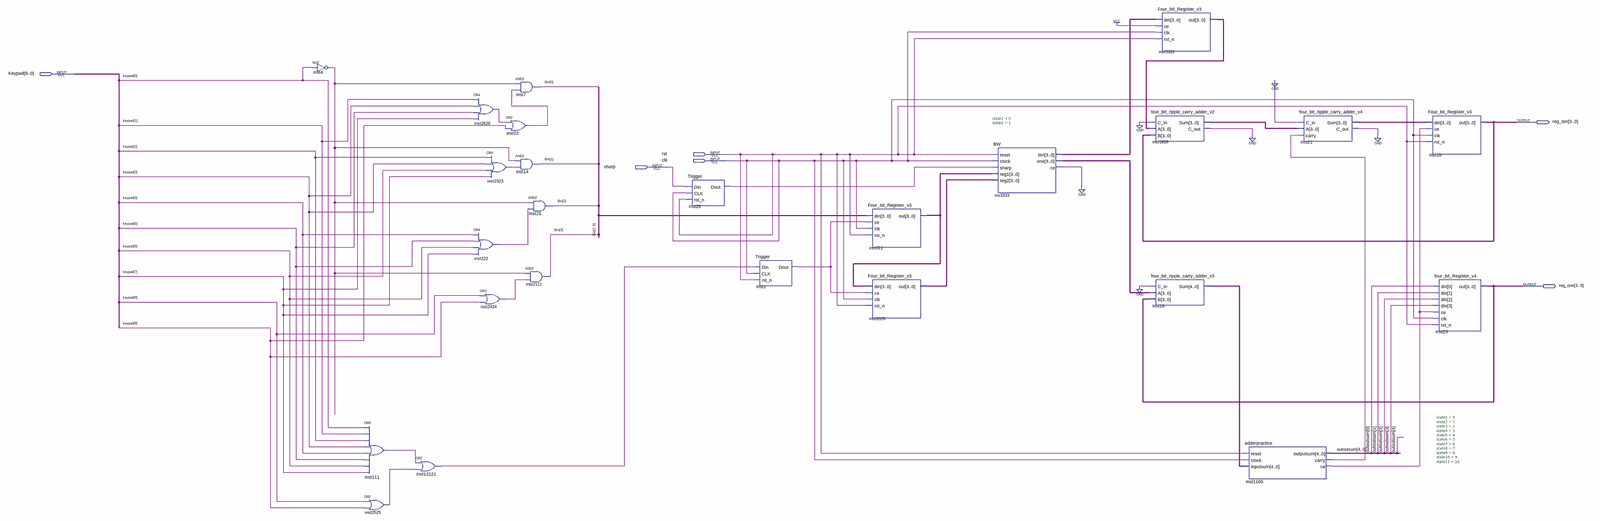
[diagram p0: schematic sheet, whole]
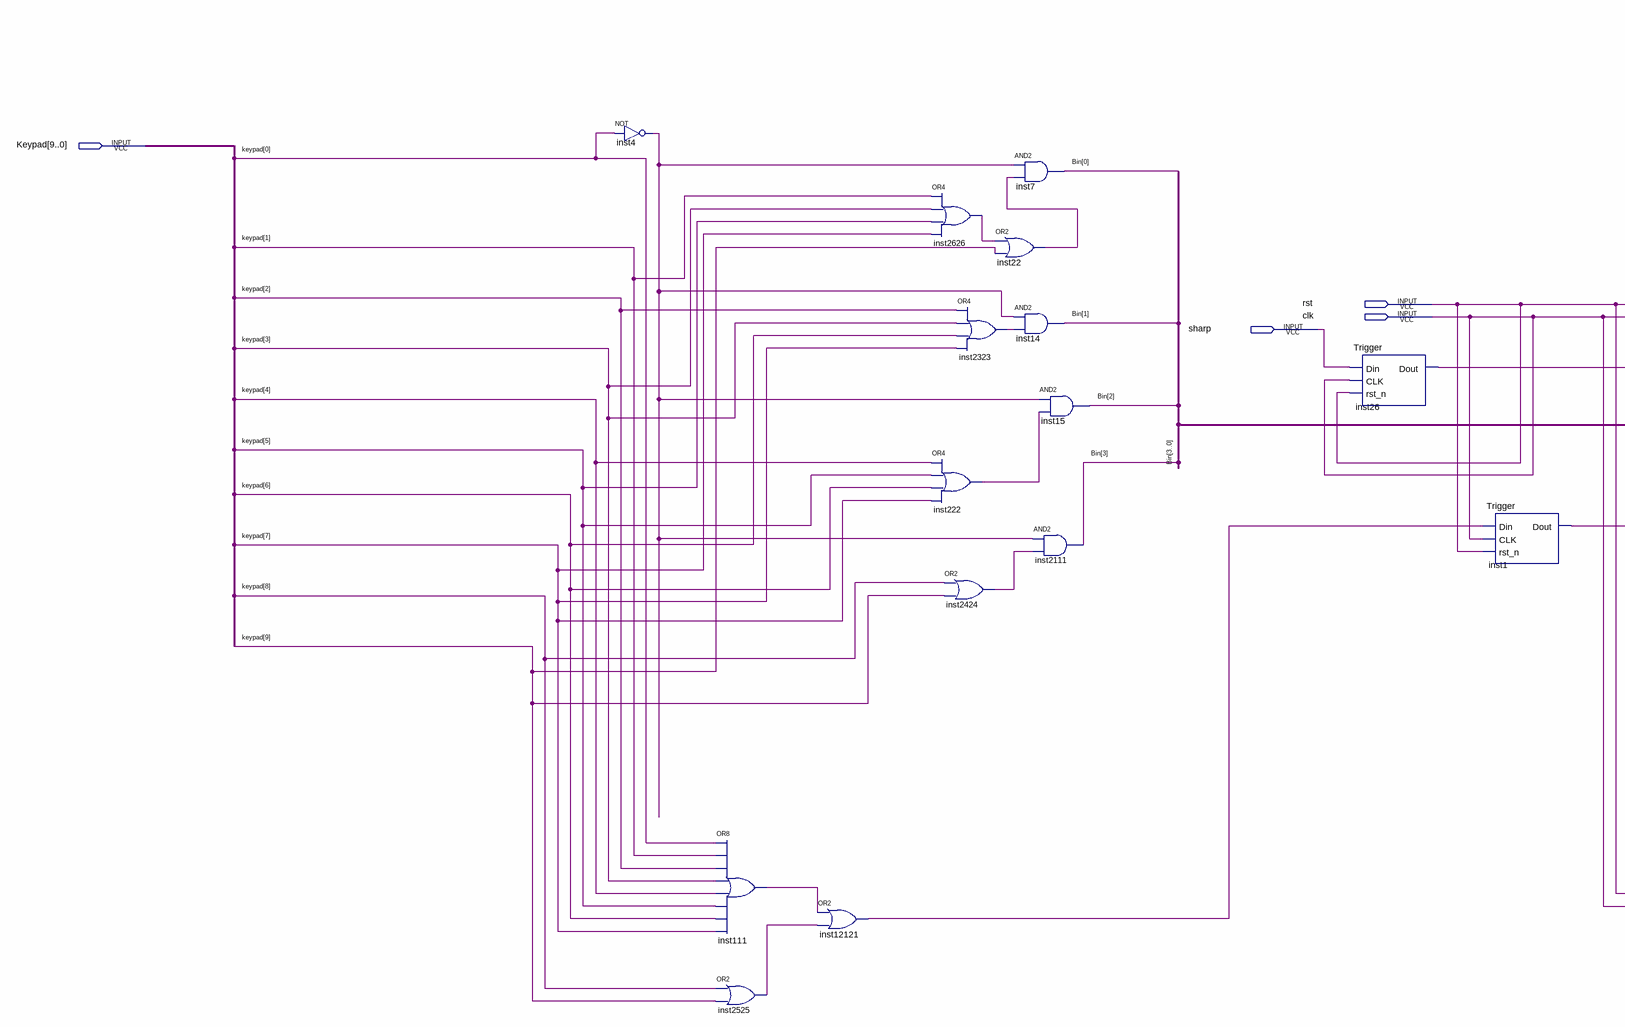
[diagram p1: schematic sheet, left part]
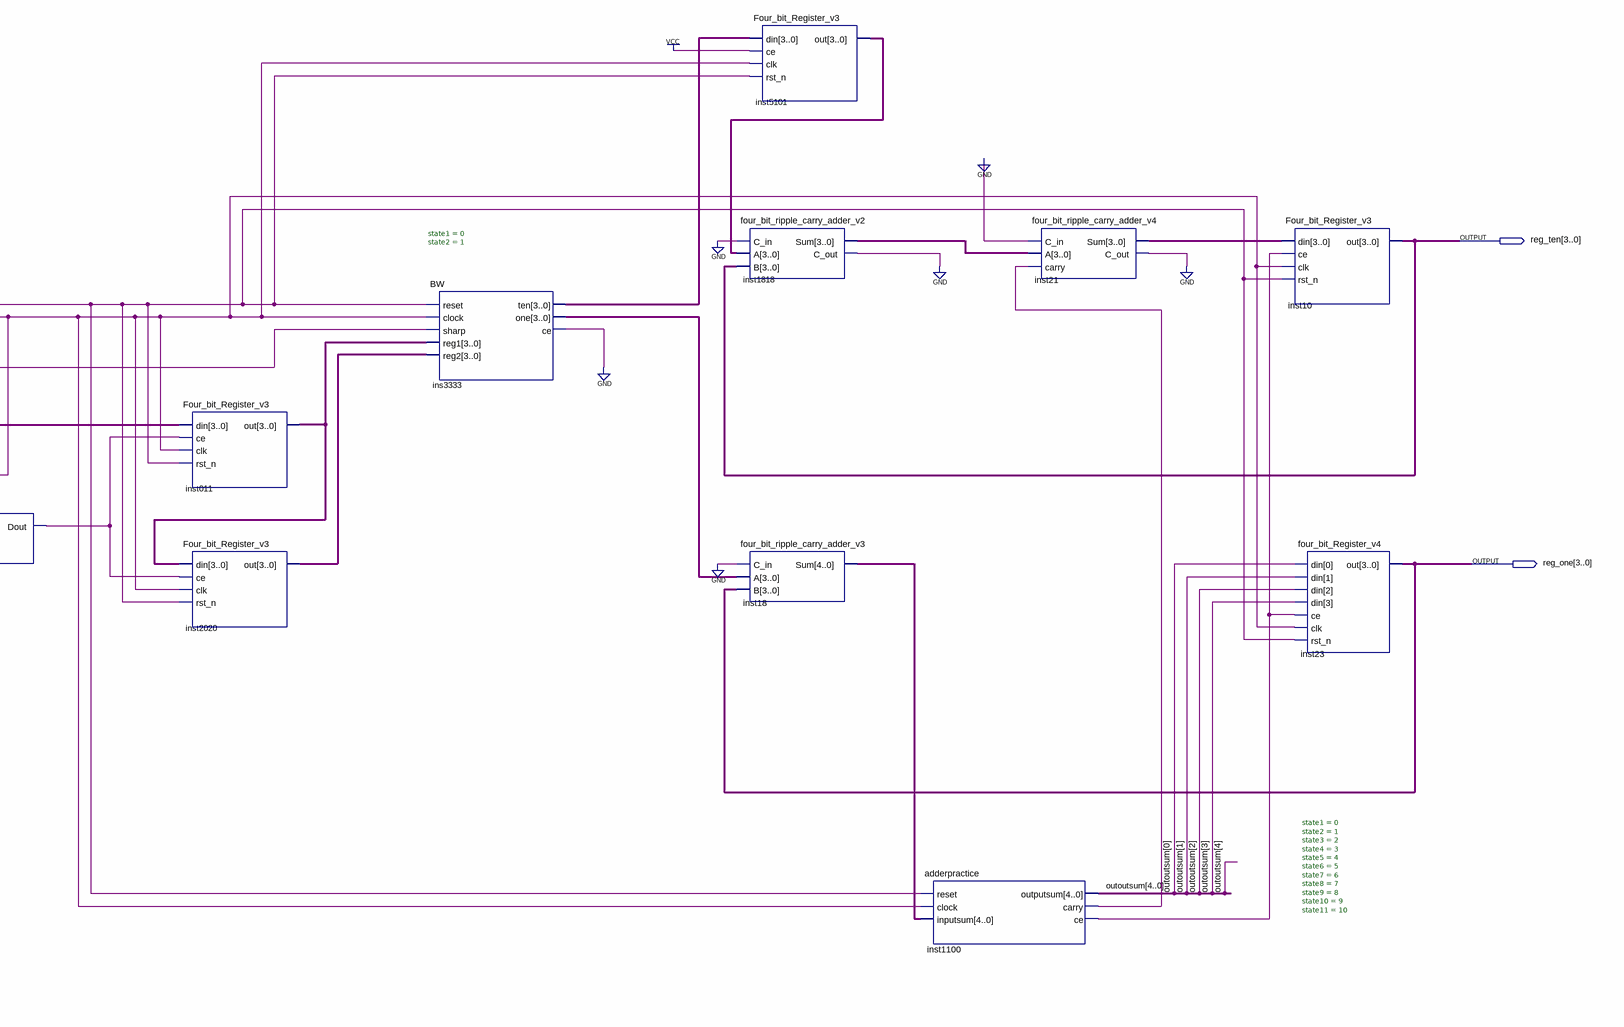
[diagram p2: schematic sheet, right part]
// Quartus schematic rnd2.bdf as structural Verilog: 25 symbols, 6 pins
module rnd2 (
  input  [9:0] Keypad,
  input  rst,
  input  clk,
  input  sharp,
  output [3:0] reg_ten,
  output [3:0] reg_one
);

  wire ins3333_ce, inst1_dout, inst4_out, inst21_c_out, inst22_out, inst26_dout, inst111_out, inst222_out,
       inst1100_carry, inst1100_ce, inst1818_c_out, inst2323_out, inst2424_out, inst2525_out, inst2626_out,
       inst12121_out;
  wire [3:0] Bin, ins3333_one, ins3333_ten, inst011_out, inst21_sum, inst1818_sum, inst2020_out, inst5101_out;
  wire [4:0] inst18_sum, outoutsum;

  not inst4 (inst4_out, Keypad[0]);
  or inst111 (inst111_out, Keypad[0], Keypad[1], Keypad[2], Keypad[3], Keypad[4], Keypad[5], Keypad[6], Keypad[7]);
  or inst2525 (inst2525_out, Keypad[8], Keypad[9]);
  or inst12121 (inst12121_out, inst111_out, inst2525_out);
  or inst2626 (inst2626_out, Keypad[1], Keypad[3], Keypad[5], Keypad[7]);
  or inst222 (inst222_out, Keypad[4], Keypad[5], Keypad[6], Keypad[7]);
  or inst2323 (inst2323_out, Keypad[2], Keypad[3], Keypad[6], Keypad[7]);
  or inst2424 (inst2424_out, Keypad[8], Keypad[9]);
  and inst7 (Bin[0], inst4_out, inst22_out);
  or inst22 (inst22_out, inst2626_out, Keypad[9]);
  and inst14 (Bin[1], inst4_out, inst2323_out);
  and inst2111 (Bin[3], inst4_out, inst2424_out);
  and inst15 (Bin[2], inst4_out, inst222_out);
  Trigger inst26 (.Din(sharp), .CLK(clk), .rst_n(rst), .Dout(inst26_dout));
  Trigger inst1 (.Din(inst12121_out), .CLK(clk), .rst_n(rst), .Dout(inst1_dout));
  Four_bit_Register_v3 inst011 (.din(Bin), .ce(inst1_dout), .clk(clk), .rst_n(rst), .out(inst011_out));
  Four_bit_Register_v3 inst2020 (.din(inst011_out), .ce(inst1_dout), .clk(clk), .rst_n(rst), .out(inst2020_out));
  BW #(.state1(0), .state2(1)) ins3333 (
    .reset(rst), .clock(clk), .sharp(inst26_dout), .reg1(inst011_out), .reg2(inst2020_out),
    .ten(ins3333_ten), .one(ins3333_one), .ce(ins3333_ce));
  Four_bit_Register_v3 inst5101 (.din(ins3333_ten), .ce(1'b1), .clk(clk), .rst_n(rst), .out(inst5101_out));
  four_bit_ripple_carry_adder_v2 inst1818 (
    .C_in(1'b0), .A(inst5101_out), .B(reg_ten), .Sum(inst1818_sum), .C_out(inst1818_c_out));
  four_bit_ripple_carry_adder_v3 inst18 (.C_in(1'b0), .A(ins3333_one), .B(reg_one), .Sum(inst18_sum));
  adderpractice #(.state1(0), .state2(1), .state3(2), .state4(3), .state5(4), .state6(5), .state7(6), .state8(7), .state9(8), .state10(9), .state11(10)) inst1100 (
    .reset(rst), .clock(clk), .inputsum(inst18_sum), .outputsum(outoutsum), .carry(inst1100_carry),
    .ce(inst1100_ce));
  four_bit_ripple_carry_adder_v4 inst21 (
    .C_in(1'b0), .A(inst1818_sum), .carry(inst1100_carry), .Sum(inst21_sum), .C_out(inst21_c_out));
  Four_bit_Register_v3 inst10 (.din(inst21_sum), .ce(inst1100_ce), .clk(clk), .rst_n(rst), .out(reg_ten));
  four_bit_Register_v4 inst23 (.din(outoutsum[3:0]), .ce(inst1100_ce), .clk(clk), .rst_n(rst), .out(reg_one));
  // also tied to GND on the sheet: {inst1818_c_out, inst21_c_out, ins3333_ce}
endmodule
